# EAGLE schematic dr-who (EAGLE 9.6.2)
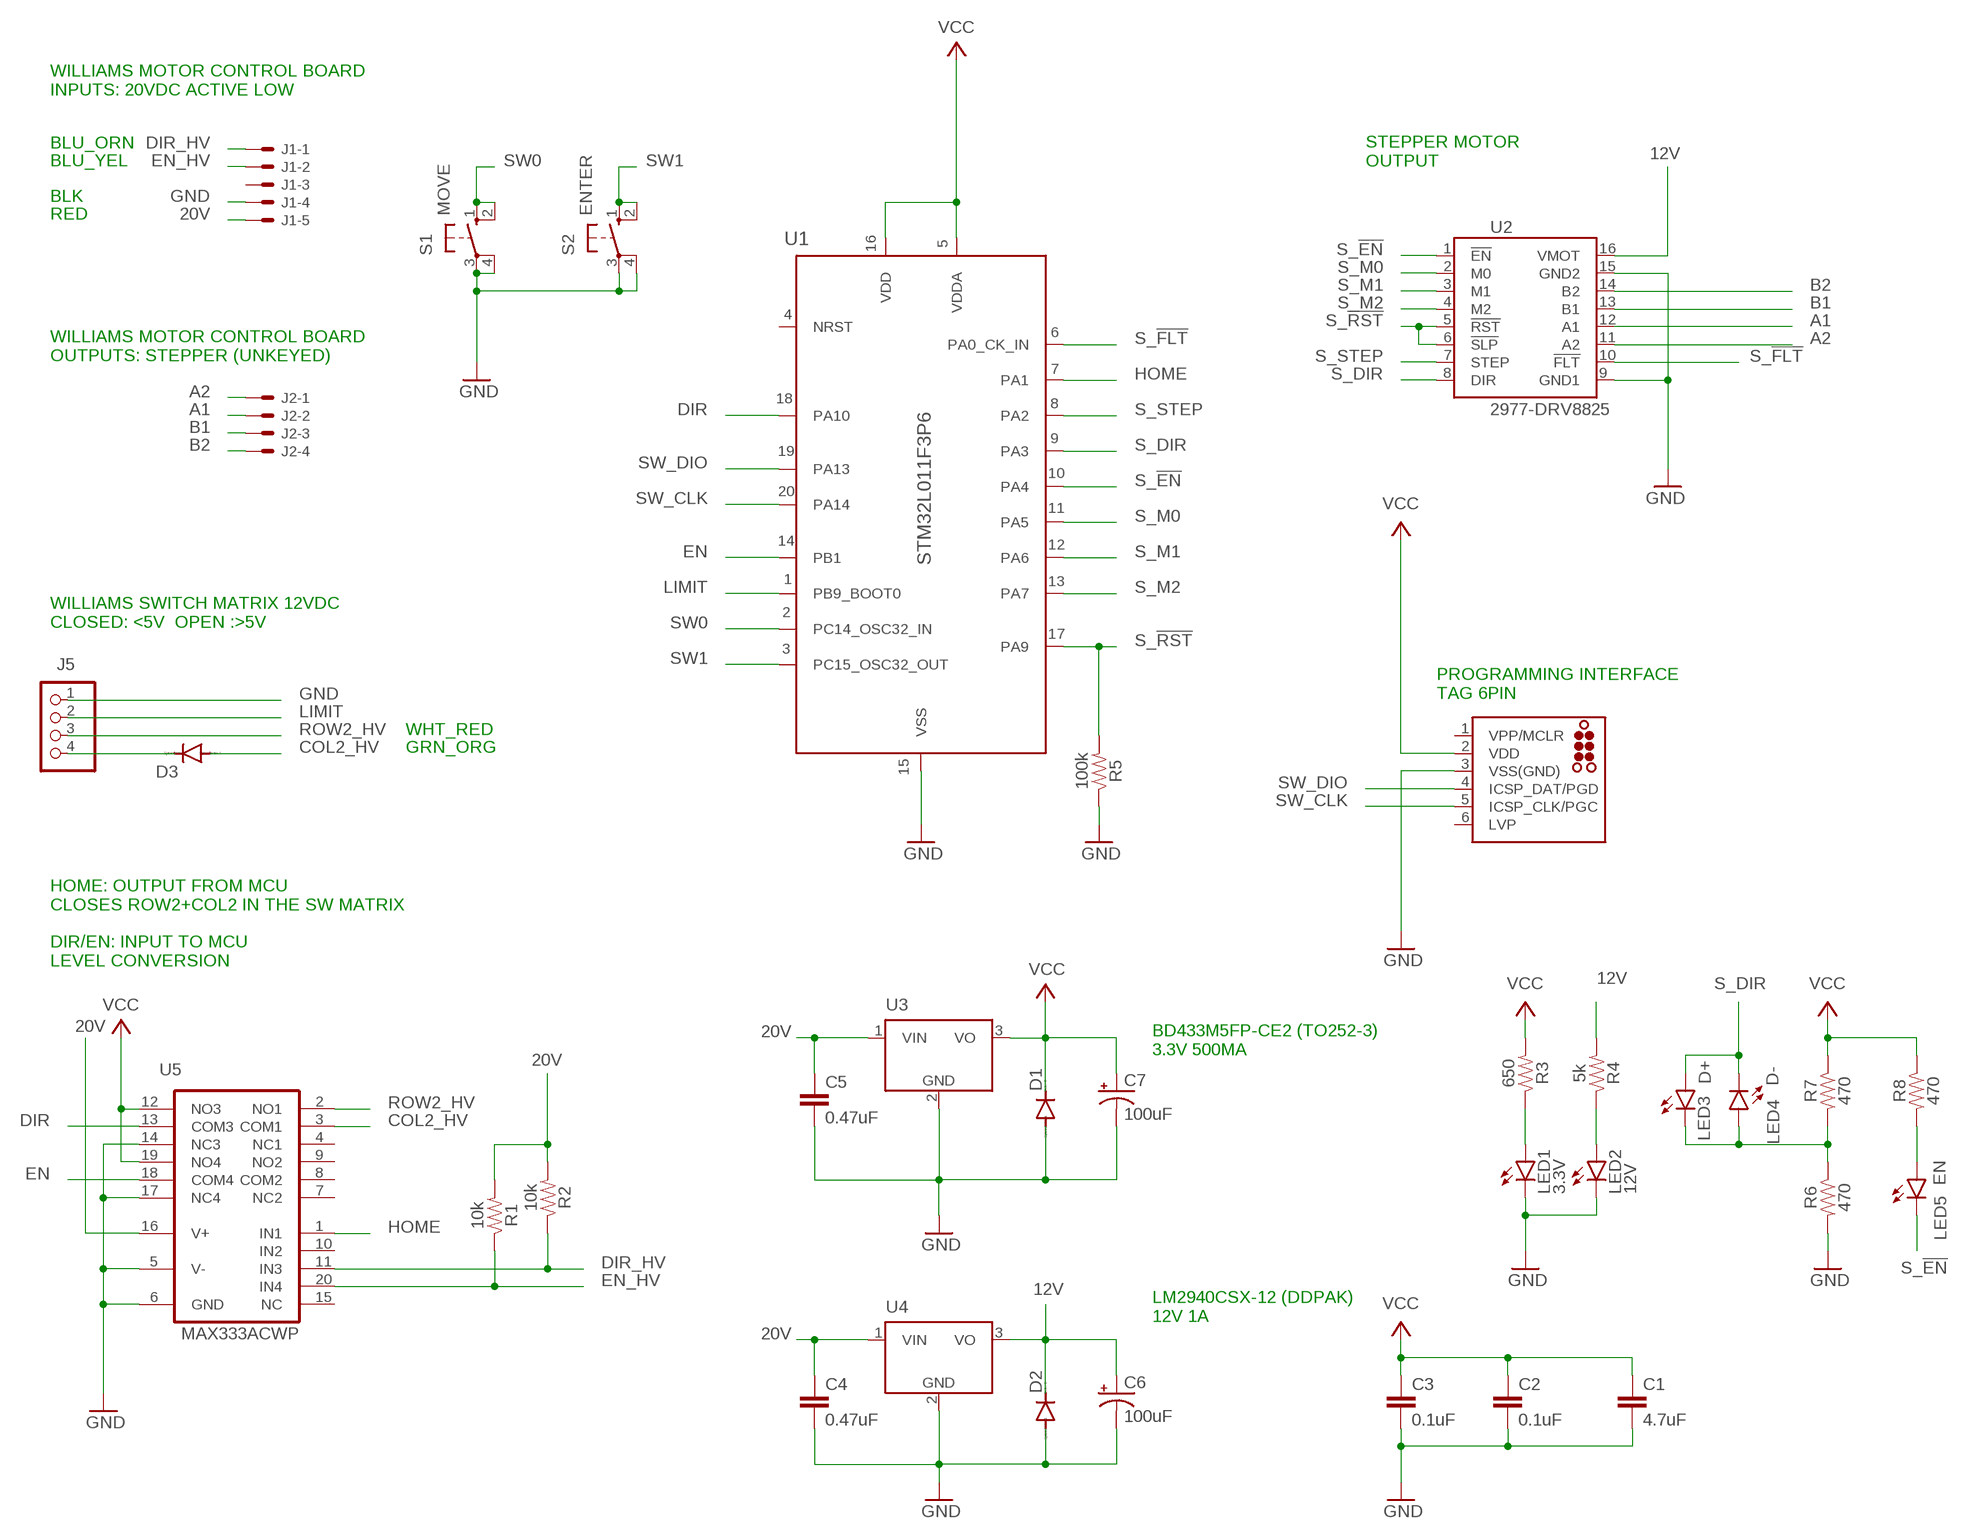
[diagram p0: schematic, sheet 1]

## Parts
C1  4.7uF  4.7UF0603  [0603]
C2  0.1uF  0.1UF-0603-25V-(+80/-20%)  [0603]
C3  0.1uF  0.1UF-0603-25V-(+80/-20%)  [0603]
C4  0.47uF  470PF-0603-50V-5%  [0603]
C5  0.47uF  470PF-0603-50V-5%  [0603]
C6  100uF  100UF-POLAR-RADIAL-2.5MM-25V-20%  [CPOL-RADIAL-2.5MM-6.5MM]
C7  100uF  100UF-POLAR-RADIAL-2.5MM-25V-20%  [CPOL-RADIAL-2.5MM-6.5MM]
D1  DIODE-SOD323-R  [SOD323-R]
D2  DIODE-SOD323-R  [SOD323-R]
D3  DIODE-SOD323-R  [SOD323-R]
J1  KK-156-5  [KK-156-5]
J2  KK-156-4  [KK-156-4]
J4  TC2030-MCP-NL  [TC2030-MCP-NL]
J5  PINHD-1X4  [1X04]
LED1  3.3V  LED3MM  [LED3MM]
LED2  12V  LED3MM  [LED3MM]
LED3  D+  LED3MM  [LED3MM]
LED4  D-  LED3MM  [LED3MM]
LED5  EN  LED3MM  [LED3MM]
R1  10k  10KOHM-0603-1/10W-1%  [0603]
R2  10k  10KOHM-0603-1/10W-1%  [0603]
R3  650  10KOHM-0603-1/10W-1%  [0603]
R4  5k  10KOHM-0603-1/10W-1%  [0603]
R5  100k  10KOHM-0603-1/10W-1%  [0603]
R6  470  10KOHM-0603-1/10W-1%  [0603]
R7  470  10KOHM-0603-1/10W-1%  [0603]
R8  470  10KOHM-0603-1/10W-1%  [0603]
S1  MOVE  40/XX  [B3F/40XX]
S2  ENTER  40/XX  [B3F/40XX]
U1  STM32L011F3P6  [TSSOP20-I]
U2  2977-DRV8825  [DRV8825]
U3  LM2936DT-3.3  [TO252]
U4  LM2936D2PAK  [D2PAK]
U5  MAX333ACWP  [SO20L]

## Nets
12V [fat]: C6.1(+) D2.C R4.2 U2.16(VMOT) U4.3(VO)
20V [fat]: C4.1 C5.1 J1.5 R1.2 R2.2 U3.1(VIN) U4.1(VIN) U5.16(V+)
A1 [fat]: J2.2 U2.12(A1)
A2 [fat]: J2.1 U2.11(A2)
B1 [fat]: J2.3 U2.13(B1)
B2 [fat]: J2.4 U2.14(B2)
COL2_HV: D3.A U5.3(COM1)
DIR: U1.18(PA10) U5.13(COM3)
DIR_HV: J1.1 R2.1 U5.11(IN3)
EN: U1.14(PB1) U5.18(COM4)
EN_HV: J1.2 R1.1 U5.20(IN4)
GND [medium]: C1.2 C2.2 C3.2 C4.2 C5.2 C6.2(-) C7.2(-) D1.A D2.A J1.4 J4.3(VSS(GND)) J5.1 LED1.K(C) LED2.K(C) R5.1 R6.2 S1.3(P) S1.4(P1) S2.3(P) S2.4(P1) U1.15(VSS) U2.9(GND1) U2.15(GND2) U3.2(GND) U4.2(GND) U5.5(V-) U5.6(GND) U5.14(NC3) U5.17(NC4)
HOME: U1.7(PA1) U5.1(IN1)
LIMIT: J5.2 U1.1(PB9_BOOT0)
N$1: D3.C J5.4
N$4: LED3.K(C) LED4.A R6.1 R7.2
N$5: LED5.A R8.2
N$6: LED1.A R3.1
N$7: LED2.A R4.1
ROW2_HV: J5.3 U5.2(NO1)
S_!EN: LED5.K(C) U1.10(PA4) U2.1(!EN)
S_!FLT: U1.6(PA0_CK_IN) U2.10(!FLT)
S_!RST: R5.2 U1.17(PA9) U2.5(!RST) U2.6(!SLP)
S_DIR: LED3.A LED4.K(C) U1.9(PA3) U2.8(DIR)
S_M0: U1.11(PA5) U2.2(M0)
S_M1: U1.12(PA6) U2.3(M1)
S_M2: U1.13(PA7) U2.4(M2)
S_STEP: U1.8(PA2) U2.7(STEP)
SW0: S1.1(S) S1.2(S1) U1.2(PC14_OSC32_IN)
SW1: S2.1(S) S2.2(S1) U1.3(PC15_OSC32_OUT)
SW_CLK: J4.5(ICSP_CLK/PGC) U1.20(PA14)
SW_DIO: J4.4(ICSP_DAT/PGD) U1.19(PA13)
VCC [medium]: C1.1 C2.1 C3.1 C7.1(+) D1.C J4.2(VDD) R3.2 R7.1 R8.1 U1.5(VDDA) U1.16(VDD) U3.3(VO) U5.12(NO3) U5.19(NO4)
Unconnected: J1.3 J4.1(VPP/MCLR) J4.6(LVP) U1.4(NRST) U5.4(NC1) U5.7(NC2) U5.8(COM2) U5.9(NO2) U5.10(IN2) U5.15(NC)

## Notes on the sheet
- WILLIAMS MOTOR CONTROL BOARD 
  INPUTS: 20VDC ACTIVE LOW
- BLU_ORN
- BLU_YEL
- STEPPER MOTOR
  OUTPUT
- BLK
- RED
- WILLIAMS MOTOR CONTROL BOARD 
  OUTPUTS: STEPPER (UNKEYED)
- WILLIAMS SWITCH MATRIX 12VDC
  CLOSED: <5V  OPEN :>5V
- PROGRAMMING INTERFACE
  TAG 6PIN
- WHT_RED
- GRN_ORG
- HOME: OUTPUT FROM MCU
  CLOSES ROW2+COL2 IN THE SW MATRIX
  
  DIR/EN: INPUT TO MCU
  LEVEL CONVERSION
- BD433M5FP-CE2 (TO252-3)
  3.3V 500MA
- LM2940CSX-12 (DDPAK)
  12V 1A

## Library data of the parts
C1 = SparkFun-Capacitors:4.7UF: 4.7µF ceramic capacitors A capacitor is a passive two-terminal electrical component used to store electrical energy temporarily in an electric field.; PROD_ID: CAP-08280
C2 C3 = SparkFun-Capacitors:0.1UF: 0.1µF ceramic capacitors A capacitor is a passive two-terminal electrical component used to store electrical energy temporarily in an electric field.; PROD_ID: CAP-00810
C4 C5 = SparkFun-Capacitors:470PF: 470pF ceramic capacitors A capacitor is a passive two-terminal electrical component used to store electrical energy temporarily in an electric field.; PROD_ID: CAP-07884; VALUE: 470pF
C6 C7 = SparkFun-Capacitors:100UF-POLAR: 100µF polarized capacitors A capacitor is a passive two-terminal electrical component used to store electrical energy temporarily in an electric field.; PROD_ID: CAP-08439
D1-D3 = diode-b:DIODE-: DIODE
J1 = con-molexb:KK-156-5: KK 156 HEADER Source: http://www.molex.com/pdm_docs/sd/026604100_sd.pdf; MF: MOLEX; OC_FARNELL: unknown; OC_NEWARK: unknown
J2 = con-molexb:KK-156-4: KK 156 HEADER Source: http://www.molex.com/pdm_docs/sd/026604100_sd.pdf; MF: MOLEX; OC_FARNELL: unknown; OC_NEWARK: unknown
J4 = tag-connect:TC2030: TAG-CONNECT ICSP Connector Manufacturer: Tag-Connect <http://www.tag-connect.com> Cable for easy In-Circuit Serial Programming. Designed for Microchip ICD2, suitable for many others. Two variants - one "with legs" (for hands-free fit on PCB) and another "without legs" for quick programming. PAD Description 1 MCLR/Vpp 2 Vdd 3 GND 4 PGD (ISPDAT) 5 PGC (ISPCLK) 6 nc (used for LVP) ©2009 ROFA.cz - modified and updated by Robert Darlington ‹rdarlington@gmail.com›
J5 = pinhead:PINHD-1X4: PIN HEADER
LED1-LED5 = led-b:LED: LED OSRAM: - CHIPLED LG R971, LG N971, LY N971, LG Q971, LY Q971, LO R971, LY R971 LH N974, LH R974 LS Q976, LO Q976, LY Q976 LO Q996 - Hyper CHIPLED LW Q18S LB Q993, LB Q99A, LB R99A - SideLED LS A670, LO A670, LY A670, LG A670, LP A670 LB A673, LV A673, LT A673, LW A673 LH A674 LY A675 LS A676, LA A676, LO A676, LY A676, LW A676 LS A679, LY A679, LG A679 - Hyper Micro SIDELED® LS Y876, LA Y876, LO Y876, LY Y876 LT Y87S - SmartLED LW L88C, LW L88S LB L89C, LB L89S, LG L890 LS L89K, LO L89K, LY L89K LS L896, LA L896, LO L896, LY L896 - TOPLED LS T670, LO T670, LY T670, LG T670, LP T670 LSG T670, LSP T670, LSY T670, LOP T670, LYG T670 LG T671, LOG T671, LSG T671 LB T673, LV T673, LT T673, LW T673 LH T674 LS T676, LA T676, LO T676, LY T676, LB T676, LH T676, LSB T676, LW T676 LB T67C, LV T67C, LT T67C, LS T67K, LO T67K, LY T67K, LW E67C LS E67B, LA E67B, LO E67B, LY E67B, LB E67C, LV E67C, LT E67C LW T67C LS T679, LY T679, LG T679 LS T770, LO T770, LY T770, LG T770, LP T770 LB T773, LV T773, LT T773, LW T773 LH T774 LS E675, LA E675, LY E675, LS T675 LS T776, LA T776, LO T776, LY T776, LB T776 LHGB T686 LT T68C, LB T68C - Hyper Mini TOPLED® LB M676 - Mini TOPLED Santana® LG M470 LS M47K, LO M47K, LY M47K Source: http://www.osram.convergy.de LUXEON: - LUMILED® LXK2-PW12-R00, LXK2-PW12-S00, LXK2-PW14-U00, LXK2-PW14-V00 LXK2-PM12-R00, LXK2-PM12-S00, LXK2-PM14-U00 LXK2-PE12-Q00, LXK2-PE12-R00, LXK2-PE12-S00, LXK2-PE14-T00, LXK2-PE14-U00 LXK2-PB12-K00, LXK2-PB12-L00, LXK2-PB12-M00, LXK2-PB14-N00, LXK2-PB14-P00, LXK2-PB14-Q00 LXK2-PR12-L00, LXK2-PR12-M00, LXK2-PR14-Q00, LXK2-PR14-R00 LXK2-PD12-Q00, LXK2-PD12-R00, LXK2-PD12-S00 LXK2-PH12-R00, LXK2-PH12-S00 LXK2-PL12-P00, LXK2-PL12-Q00, LXK2-PL12-R00 Source: www.luxeon.com KINGBRIGHT: KA-3528ASYC Source: www.kingbright.com
R1 R2 = SparkFun-Resistors:10KOHM: 10kΩ resistor A resistor is a passive two-terminal electrical component that implements electrical resistance as a circuit element. Resistors act to reduce current flow, and, at the same time, act to lower voltage levels within circuits. - Wikipedia; PROD_ID: RES-00824
R3-R8 = SparkFun-Resistors:10KOHM: 10kΩ resistor A resistor is a passive two-terminal electrical component that implements electrical resistance as a circuit element. Resistors act to reduce current flow, and, at the same time, act to lower voltage levels within circuits. - Wikipedia; PROD_ID: RES-00824; VALUE: 10k
S1 S2 = switch-omron:40/XX: OMRON SWITCH; OC_FARNELL: unknown; OC_NEWARK: unknown
U1 = STM32L011F3P6:STM32L011F3P6: IC
U2 = pololu-stepper-driver:2977-DRV8825: DRV8825 Stepper Motor Driver Carrier; High Current (Bulk; No Header Pins) #2977 DRV8825 Stepper Motor Driver Carrier; High Current (Bulk; No Header Pins) <https://www.pololu.com/product/2977> in Japan, Suzaku Lab. Ltd. <https://suzakugiken.jp/> #2977 DRV8825 大電流ステッピングモータドライバボード (バルク品 ピンヘッダ無し) <https://szc.jp/po2977>
U3 = national-semiconductor:LM2936?*: Ultra-Low Quiescent Current LDO Voltage Regulator Source: Data sheet <http://www.national.com/ds/LM/LM2936.pdf>; MPN: BD433M5FP-CE2; OC_FARNELL: 1286863; OC_NEWARK: 26M0361
U4 = national-semiconductor:LM2936?*: Ultra-Low Quiescent Current LDO Voltage Regulator Source: Data sheet <http://www.national.com/ds/LM/LM2936.pdf>
U5 = maxim:MAX333ACWP: ANALOG SWITCH; MF: MAXIM; MPN: MAX333ACWP+; OC_FARNELL: 9725547; OC_NEWARK: 28K3302

## Net classes
0 default: width 0.102 mm
1 fat: width 0.406 mm
2 medium: width 0.203 mm